# Altium project WanderDrive.PrjPcb (part 4 of 5)

## Sheet WanderDrive_AbsEnc.SchDoc
size A3; Date: Not shown in title block; ApprovedBy: Not shown in title block; CheckedBy: Not shown in title block; Author: Not shown in title block; CompanyName: Not shown in title block; Engineer: Not shown in title block; Organization: Not shown in title block; Address1: Not shown in title block; Address2: Not shown in title block; Address3: Not shown in title block; Address4: Not shown in title block; DocumentNumber: 1; Revision: Use project parameter SCH_Rev; SheetNumber: 3; SheetTotal: 4; PageSetup: Record=PageOptions|CenterHorizontal=True|CenterVertical=True|PrintScale=1.00|XCorrection=1.00|YCorrection=1.00|PrintKind=0|BorderSize=5000000|LeftOffset=0|BottomOffset=0|Orientation=2|PaperLength=1000|PaperWidth=1000|Scale=100|PaperSource=15|PrintQuality=600|MediaType=1|DitherType=10|PaperKind=Letter|PrintScaleMode=1; CurrentTime: Not shown in title block; CurrentDate: Not shown in title block; Time: Not shown in title block; DocumentFullPathAndName: Not shown in title block; DocumentName: Not shown in title block; ModifiedDate: Not shown in title block; ImagePath: Not shown in title block
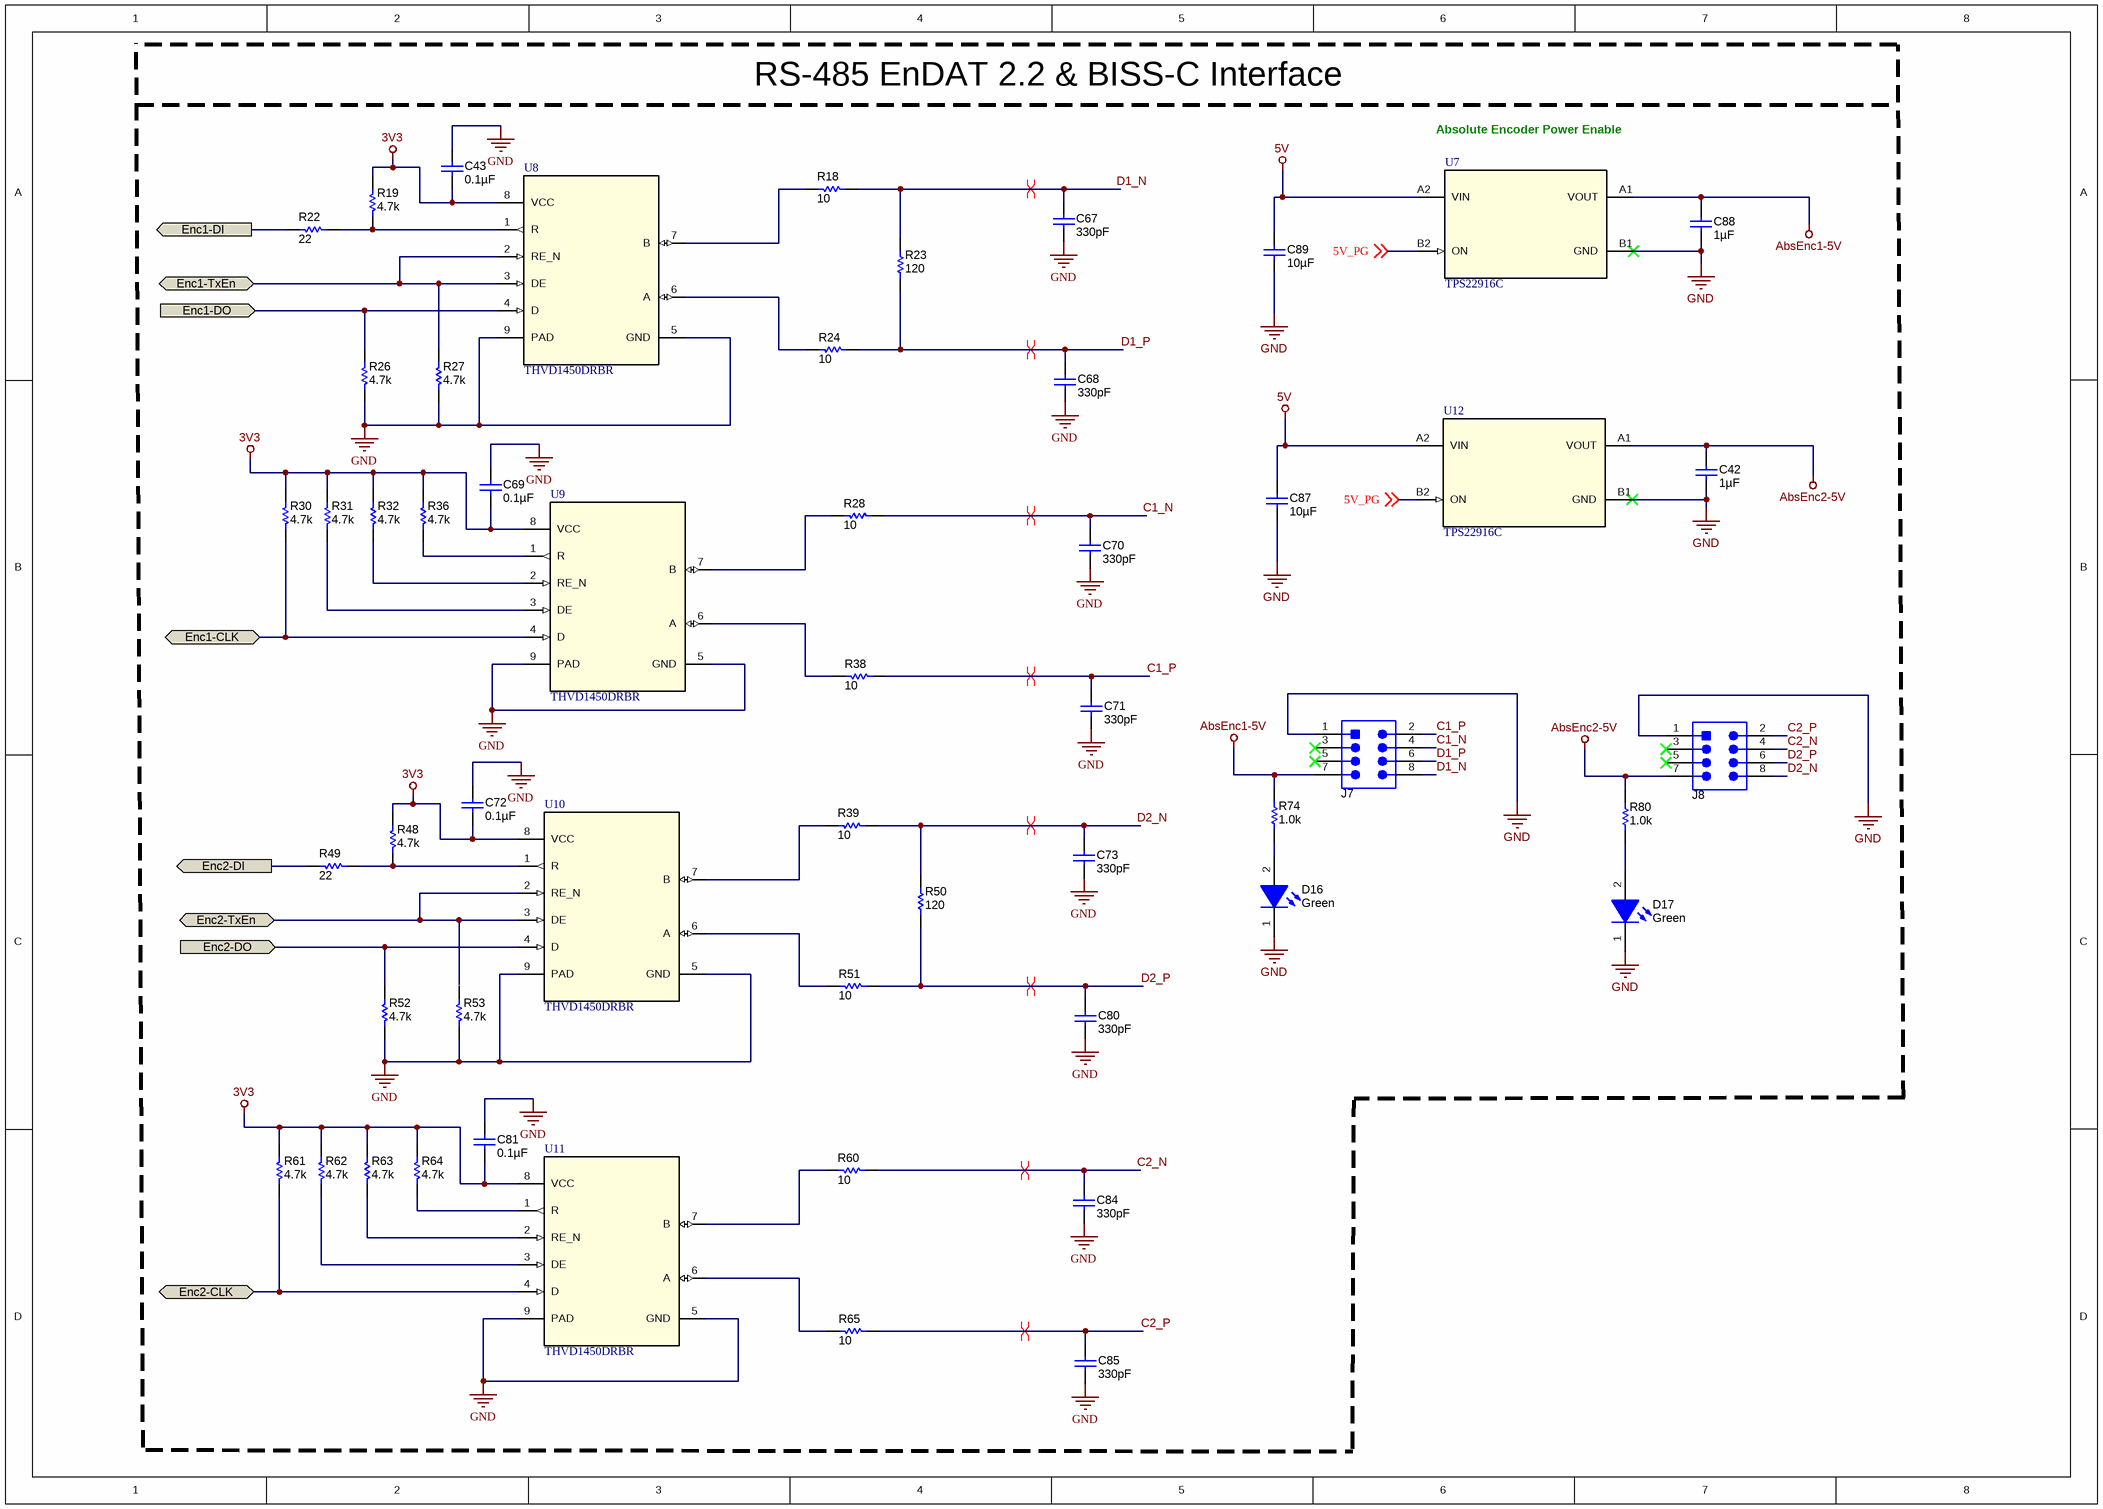
[diagram p2: WanderDrive_AbsEnc.SchDoc]

### Parts
C42  ValueDisplayed: 1µF  [0805_HV]  (hidden comment: TMK212BJ105KG-T)
C43  ValueDisplayed: 0.1µF  [0603]  (hidden comment: 06033D104KAT2A)
C67  ValueDisplayed: 330pF  [0603]  (hidden comment: GRM188R71H331KA01D)
C68  ValueDisplayed: 330pF  [0603]  (hidden comment: GRM188R71H331KA01D)
C69  ValueDisplayed: 0.1µF  [0603]  (hidden comment: 06033D104KAT2A)
C70  ValueDisplayed: 330pF  [0603]  (hidden comment: GRM188R71H331KA01D)
C71  ValueDisplayed: 330pF  [0603]  (hidden comment: GRM188R71H331KA01D)
C72  ValueDisplayed: 0.1µF  [0603]  (hidden comment: 06033D104KAT2A)
C73  ValueDisplayed: 330pF  [0603]  (hidden comment: GRM188R71H331KA01D)
C80  ValueDisplayed: 330pF  [0603]  (hidden comment: GRM188R71H331KA01D)
C81  ValueDisplayed: 0.1µF  [0603]  (hidden comment: 06033D104KAT2A)
C84  ValueDisplayed: 330pF  [0603]  (hidden comment: GRM188R71H331KA01D)
C85  ValueDisplayed: 330pF  [0603]  (hidden comment: GRM188R71H331KA01D)
C87  ValueDisplayed: 10µF  [0805_HV]  (hidden comment: GRM21BR61E106KA73L)
C88  ValueDisplayed: 1µF  [0805_HV]  (hidden comment: TMK212BJ105KG-T)
C89  ValueDisplayed: 10µF  [0805_HV]  (hidden comment: GRM21BR61E106KA73L)
D16  value Green  [WL-SMCW_GREEN]  (hidden comment: 150060GS75000)
D17  value Green  [WL-SMCW_GREEN]  (hidden comment: 150060GS75000)
J7  70246-0801  [Molex_70246-0801]  (value not drawn)
J8  70246-0801  [Molex_70246-0801]  (value not drawn)
R18  value 10  [0603]  (hidden comment: CRCW060310R0JNEAHP)
R19  value 4.7k  [0603]  (hidden comment: CRCW06034K70JNEA)
R22  value 22  [0603]  (hidden comment: CRCW060322R0JNEA)
R23  ValueDisplayed: 120  [0603]  (hidden comment: CRCW0603120RJNEA)
R24  value 10  [0603]  (hidden comment: CRCW060310R0JNEAHP)
R26  value 4.7k  [0603]  (hidden comment: CRCW06034K70JNEA)
R27  value 4.7k  [0603]  (hidden comment: CRCW06034K70JNEA)
R28  value 10  [0603]  (hidden comment: CRCW060310R0JNEAHP)
R30  value 4.7k  [0603]  (hidden comment: CRCW06034K70JNEA)
R31  value 4.7k  [0603]  (hidden comment: CRCW06034K70JNEA)
R32  value 4.7k  [0603]  (hidden comment: CRCW06034K70JNEA)
R36  value 4.7k  [0603]  (hidden comment: CRCW06034K70JNEA)
R38  value 10  [0603]  (hidden comment: CRCW060310R0JNEAHP)
R39  value 10  [0603]  (hidden comment: CRCW060310R0JNEAHP)
R48  value 4.7k  [0603]  (hidden comment: CRCW06034K70JNEA)
R49  value 22  [0603]  (hidden comment: CRCW060322R0JNEA)
R50  ValueDisplayed: 120  [0603]  (hidden comment: CRCW0603120RJNEA)
R51  value 10  [0603]  (hidden comment: CRCW060310R0JNEAHP)
R52  value 4.7k  [0603]  (hidden comment: CRCW06034K70JNEA)
R53  value 4.7k  [0603]  (hidden comment: CRCW06034K70JNEA)
R60  value 10  [0603]  (hidden comment: CRCW060310R0JNEAHP)
R61  value 4.7k  [0603]  (hidden comment: CRCW06034K70JNEA)
R62  value 4.7k  [0603]  (hidden comment: CRCW06034K70JNEA)
R63  value 4.7k  [0603]  (hidden comment: CRCW06034K70JNEA)
R64  value 4.7k  [0603]  (hidden comment: CRCW06034K70JNEA)
R65  value 10  [0603]  (hidden comment: CRCW060310R0JNEAHP)
R74  ValueDisplayed: 1.0k  [0402]  (hidden comment: CRCW04021K00JNED)
R80  ValueDisplayed: 1.0k  [0402]  (hidden comment: CRCW04021K00JNED)
U7  TPS22916C  [YFP0004ABAB]
U8  THVD1450DRBR  [DRB0008F]
U9  THVD1450DRBR  [DRB0008F]
U10  THVD1450DRBR  [DRB0008F]
U11  THVD1450DRBR  [DRB0008F]
U12  TPS22916C  [YFP0004ABAB]

### Ports
Enc1-CLK (bidir), Enc1-DI (out), Enc1-DO (in), Enc1-TxEn (bidir), Enc2-CLK (bidir), Enc2-DI (out), Enc2-DO (in), Enc2-TxEn (bidir)

### Nets
3V3: C43.1 C69.1 C72.1 C81.1 R19.2 R30.1 R31.1 R32.1 R36.1 R48.2 R61.1 R62.1 R63.1 R64.1 U8.8(VCC) U9.8(VCC) U10.8(VCC) U11.8(VCC)
5V: C87.1 C89.1 U7.A2(VIN) U12.A2(VIN)
AbsEnc1-5V: C88.1 J7.7 R74.2 U7.A1(VOUT)
AbsEnc2-5V: C42.1 J8.7 R80.2 U12.A1(VOUT)
GND: C42.2 C43.2 C67.1 C68.2 C69.2 C70.1 C71.2 C72.2 C73.1 C80.2 C81.2 C84.1 C85.2 C87.2 C88.2 C89.2 D16.1(K) D17.1(K) J7.1 J8.1 R26.2 R27.2 R52.2 R53.2 U7.B1(GND) U8.5(GND) U8.9(PAD) U9.5(GND) U9.9(PAD) U10.5(GND) U10.9(PAD) U11.5(GND) U11.9(PAD) U12.B1(GND)
5V_PG: U7.B2(ON) U12.B2(ON) ; off-sheet 5V_PG
C1_N: C70.2 J7.4 R28.1
C1_P: C71.1 J7.2 R38.1
C2_N: C84.2 J8.4 R60.1
C2_P: C85.1 J8.2 R65.1
D1_N: C67.2 J7.8 R18.1 R23.2
D1_P: C68.1 J7.6 R23.1 R24.1
D2_N: C73.2 J8.8 R39.1 R50.2
D2_P: C80.1 J8.6 R50.1 R51.1
Enc1-CLK: R30.2 U9.4(D) ; port Enc1-CLK
Enc1-DI: R22.2 ; port Enc1-DI
Enc1-DO: R26.1 U8.4(D) ; port Enc1-DO
Enc1-TxEn: U8.2(RE_N) U8.3(DE) ; port Enc1-TxEn
Enc2-CLK: R61.2 U11.4(D) ; port Enc2-CLK
Enc2-DI: R49.2 ; port Enc2-DI
Enc2-DO: R52.1 U10.4(D) ; port Enc2-DO
Enc2-TxEn: U10.2(RE_N) U10.3(DE) ; port Enc2-TxEn
NetD16_2: D16.2(A) R74.1
NetD17_2: D17.2(A) R80.1
NetR18_2: R18.2 U8.7(B)
NetR19_1: R19.1 R22.1 U8.1(R)
NetR24_2: R24.2 U8.6(A)
NetR28_2: R28.2 U9.7(B)
NetR31_2: R31.2 U9.3(DE)
NetR32_2: R32.2 U9.2(RE_N)
NetR36_2: R36.2 U9.1(R)
NetR38_2: R38.2 U9.6(A)
NetR39_2: R39.2 U10.7(B)
NetR48_1: R48.1 R49.1 U10.1(R)
NetR51_2: R51.2 U10.6(A)
NetR60_2: R60.2 U11.7(B)
NetR62_2: R62.2 U11.3(DE)
NetR63_2: R63.2 U11.2(RE_N)
NetR64_2: R64.2 U11.1(R)
NetR65_2: R65.2 U11.6(A)

Not connected (* = marked no-connect by the designer): J7 3* 5*; J8 3* 5*; R27 1; R53 1

### Layout directives
differential pair: C1_N, C1_P, C2_N, C2_P, D1_N, D1_P, D2_N, D2_P

### Notes on the sheet
- RS-485 EnDAT 2.2 & BISS-C Interface
- Absolute Encoder Power Enable
- Drawn By:
- SVN Rev:
- Number:
- TID #:
- Orderable:
- Rev:
- Sheet Title:
- File:
- Project Title:
- Designed for:
- Assembly Variant:
- Mod. Date:
- Sheet:
- Size:
- of
- B
- http://www.ti.com
- Texas Instruments and/or its licensors do not warrant the accuracy or completeness of this specification or any information contained therein. Texas Instruments and/or its licensors do not warrant that this design will meet the specifications, will be suitable for your application or fit for any particular purpose, or will operate in an implementation. Texas Instruments and/or its licensors do not warrant that the design is production worthy. You should completely validate and test your design implementation to confirm the system functionality for your application.
- Engineer:
- Contact:
- © Texas Instruments

### Library data of the parts
C42 C88 = TMK212BJ105KG-T: CAP, CERM, 1 µF, 20 V, +/- 10%, X5R, 0805; Manufacturer: Taiyo Yuden; Polarized: N; CompType: Capacitor; Value: 1uF; U/M: EA; Cap_F: 0.000001; Tolerance_%: 10; Value1: Unknown; VDC_V: 20; Value2: 20V; TaMin_C: -55; TaMax_C: 85; Cap_Case: 0805; SizeArea_mm2: 2.5; SizeAreaWB_mm2: 6.75; SizeX_mm: 2; SizeY_mm: 1.25; SizeZ_mm: 1.45; AEC Category: Q200; SymbolVersion: 2008-07-09; PartNumber: TMK212BJ105KG-T; PackageReference: 0805; RoHS: Y; MountType: SMT; Technology: Ceramic; TempCo: X5R; Published: 2008-06-19; Publisher: Texas Instruments; LatestRevisionDate: 2016-07-16; ComponentLink1Description: Datasheet link; ComponentLink1URL: http://www.yuden.co.jp/ut/product/pdf/djmk_e.pdf; Supplier 1: Digi-Key; Supplier Part Number 1: 587-1291-1-ND; Supplier 2: Farnell; Supplier Part Number 2: 8031575; Supplier 3: Newark; Supplier Part Number 3: 18J2754; AEC Qualified: ?
C43 C69 C72 C81 = 06033D104KAT2A: CAP, CERM, 0.1uF, 25V, +/-10%, X5R, 0603; Manufacturer: AVX; Polarized: N; CompType: Capacitor; U/M: EA; Cap_F: 0.0000001; Tolerance_%: 10; ESR_Ohm: 0.048; Value1: 0.048 ohm; VDC_V: 25; IRMS_A: 0.53; TaMin_C: -55; TaMax_C: 85; SymbolVersion: 2008-07-09; Value: 0.1uF; PartNumber: 06033D104KAT2A; PackageReference: 0603; RoHS: Y; Value2: 25V; MountType: SMT; Technology: Ceramic; TempCo: X5R; Cap_Case: 0603; Published: 2008-06-19; Publisher: Texas Instruments; LatestRevisionDate: 2014-03-28; ComponentLink1Description: Datasheet link; ComponentLink1URL: http://www.avx.com/docs/masterpubs/smccp.pdf; Supplier 1: Digi-Key; Supplier Part Number 1: 478-1244-1-ND; Supplier 2: Mouser; Supplier Part Number 2: 581-06033D104K
C67 C68 C70 C71 C73 C80 C84 C85 = GRM188R71H331KA01D: CAP, CERM, 330pF, 50V, +/-10%, X7R, 0603; Manufacturer: MuRata; Polarized: N; CompType: Capacitor; U/M: EA; Cap_F: 0.00000000033; Tolerance_%: 10; Value1: Unknown; VDC_V: 50; TaMin_C: -55; TaMax_C: 125; SymbolVersion: 2008-07-09; Value: 330pF; PartNumber: GRM188R71H331KA01D; PackageReference: 0603; RoHS: Y; Value2: 50V; MountType: SMT; Technology: Ceramic; TempCo: X7R; Cap_Case: 0603; Published: 2008-06-19; Publisher: Texas Instruments; LatestRevisionDate: 2014-03-28; ComponentLink1Description: Datasheet link; ComponentLink1URL: http://search.murata.co.jp/Ceramy/PnsearchViewAction.do?HnOFG=ON&HnNFG=ON&SEL_CNT=50&sLang=en&sKey=GRM188R71H331KA01D&x=9&y=9&search=startwith; Supplier 1: Digi-Key; Supplier Part Number 1: 490-1486-1-ND; Supplier 2: Mouser; Supplier Part Number 2: 81-GRM188R71H331KA01; Supplier 3: Farnell; Supplier Part Number 3: 1403787
C87 C89 = GRM21BR61E106KA73L: CAP, CERM, 10 µF, 25 V,+/- 10%, X5R, 0805; Manufacturer: MuRata; Polarized: N; CompType: Capacitor; Value: 10uF; U/M: EA; Cap_F: 0.00001; Tolerance_%: 10; Value1: Unknown; VDC_V: 25; Value2: 25V; TaMin_C: -55; TaMax_C: 85; Cap_Case: 0805; SizeArea_mm2: 2.5; SizeAreaWB_mm2: 6.75; SizeX_mm: 2; SizeY_mm: 1.25; SizeZ_mm: 1.45; AEC Category: Q200; Green_Lifecycle: Active; Green_REACh: Passed; SymbolVersion: 2008-07-09; PartNumber: GRM21BR61E106KA73L; PackageReference: 0805; RoHS: Y; MountType: SMT; Technology: Ceramic; TempCo: X5R; Published: 2008-06-19; Publisher: Texas Instruments; LatestRevisionDate: 2017-06-02; ComponentLink1Description: Datasheet link; ComponentLink1URL: http://www.murata.com/~/media/webrenewal/support/library/catalog/products/capacitor/mlcc/c02e.ashx; Supplier 1: Digi-Key; Supplier Part Number 1: 490-5523-1-ND; Supplier 2: Newark; Supplier Part Number 2: 24R6339; Supplier 3: Mouser; Supplier Part Number 3: 81-GRM21BR61E106KA3L; AEC Qualified: ?; Green_EU RoHS: Passed; Green_EU RoHS-2: Incomplete
D16 D17 = 150060GS75000: LED, Green, SMD; Manufacturer: Wurth Elektronik; Type: InGaN; Vf_V: 3.2; Value2: 3.2V; Io_A: 0.02; Tjmax_C: 85; Value1: W; Angle: 140; U/M: EA; Green_Lifecycle: Active; Green_REACh: Passed; CompType: LED; PartNumber: 150060GS75000; SymbolVersion: 2008-11-06; MountType: SMT; RoHS: Y; PackageReference: LED_0603; Color: Green; Published: 2008-07-11; Publisher: Texas Instruments; ComponentLink1URL: http://katalog.we-online.de/led/datasheet/150060GS75000.pdf; ComponentLink1Description: Datasheet link; LatestRevisionDate: 2017-05-19; Supplier 1: Digi-Key; Supplier Part Number 1: 732-4971-1-ND; Supplier 2: Newark; Supplier Part Number 2: 95W3794; Supplier 3: Mouser; Supplier Part Number 3: 710-150060GS75000; Green_EU RoHS: Passed; Green_EU RoHS-2: Incomplete
J7 J8 = 70246-0801: Header(shrouded), 2.54mm, 4x2, Gold, TH; Manufacturer: Molex; SymbolCreator: a0411947; Pitch_mm: 2.54; Gender: Male; Shrouded: Y; Row_Count: 2; Current_A: 2.5; Voltage_V: 250; SymbolVersion: 2013-12-22; PartNumber: 70246-0801; PackageReference: Header(shrouded), 2.54mm, 4x2, TH; CompType: Header; RoHS: Y; MountType: TH; ComponentLink1Description: Datasheet URL; ComponentLink1URL: http://www.molex.com/pdm_docs/sd/702460801_sd.pdf; Orientation: Vertical; PinCount: 8; RowSpacing_mm: 2.54; ContactFinish: Gold; Color: Black; Cert_CSA: Y; Cert_UL: Y; Publisher: Texas Instruments; LatestRevisionDate: 2016-07-19; Supplier 1: Digi-Key; Supplier Part Number 1: 70246-0801-ND; Supplier 2: Mouser; Supplier Part Number 2: 538-70246-0801
R18 R24 R28 R38 R39 R51 R60 R65 = CRCW060310R0JNEAHP: RES, 10 ohm, 5%, 0.25W, 0603; Manufacturer: Vishay-Dale; CompType: Resistor; Value_Code: 10R0; Tolerance_%: 5; Power_W: 0.25; VDC_V: 75; TempCo: 200 ppm/C; EIA_Code: E24; U/M: EA; SymbolVersion: 2009-05-29; PartNumber: CRCW060310R0JNEAHP; PackageReference: 0603; RoHS: Y; Res_ohm: 10; Value1: 5%; Value2: 0.25W; MountType: SMT; Technology: Thick Film; Published: 2008-06-26; Publisher: Texas Instruments; LatestRevisionDate: 2014-03-15; ComponentLink1Description: Datasheet link; ComponentLink1URL: http://www.vishay.com/docs/20043/crcwhpe3.pdf; Supplier 1: Digi-Key; Supplier Part Number 1: 541-10SACT-ND; Supplier 2: Mouser; Supplier Part Number 2: 71-CRCW060310R0JNEAH; Supplier 3: Farnell; Supplier Part Number 3: 24T7074
R19 R26 R27 R30-R32 R36 R48 R52 R53 R61-R64 = CRCW06034K70JNEA: RES, 4.7k ohm, 5%, 0.1W, 0603; Manufacturer: Vishay-Dale; CompType: Resistor; Res_ohm: 4700; Value_Code: 4k70; Tolerance_%: 5; Power_W: 0.1; VDC_V: 75; TempCo: 200 ppm/C; EIA_Code: E24; U/M: EA; SymbolVersion: 2009-05-29; PartNumber: CRCW06034K70JNEA; PackageReference: 0603; RoHS: Y; Value1: 5%; Value2: 0.1W; MountType: SMT; Technology: Thick Film; Published: 2008-06-26; Publisher: Texas Instruments; LatestRevisionDate: 2014-03-15; ComponentLink1Description: Datasheet link; ComponentLink1URL: http://www.vishay.com/docs/20035/dcrcwe3.pdf; Supplier 1: Mouser; Supplier Part Number 1: 71-CRCW0603J-4.7K-E3; Supplier 2: Farnell; Supplier Part Number 2: 1652884; Supplier 3: Newark; Supplier Part Number 3: 59M6811
R22 R49 = CRCW060322R0JNEA: RES, 22 ohm, 5%, 0.1W, 0603; Manufacturer: Vishay-Dale; CompType: Resistor; Value_Code: 22R0; Tolerance_%: 5; Power_W: 0.1; VDC_V: 75; TempCo: 200 ppm/C; EIA_Code: E24; U/M: EA; SymbolVersion: 2009-05-29; PartNumber: CRCW060322R0JNEA; PackageReference: 0603; RoHS: Y; Res_ohm: 22; Value1: 5%; Value2: 0.1W; MountType: SMT; Technology: Thick Film; Published: 2008-06-26; Publisher: Texas Instruments; LatestRevisionDate: 2014-04-07; ComponentLink1Description: Datasheet link; ComponentLink1URL: http://www.vishay.com/docs/20035/dcrcwe3.pdf; Supplier 1: Digi-Key; Supplier Part Number 1: 541-22GCT-ND; Supplier 2: Mouser; Supplier Part Number 2: 71-CRCW0603J-22-E3; Supplier 3: Farnell; Supplier Part Number 3: 1692521
R23 R50 = CRCW0603120RJNEA: RES, 120, 5%, 0.1 W, 0603; Manufacturer: Vishay-Dale; CompType: Resistor; Value: 120; Value_Code: 120R; Tolerance_%: 5; Power_W: 0.1; Value2: 0.1W; VDC_V: 75; TempCo: 200 ppm/C; SizeArea_mm2: 1.28; SizeX_mm: 1.6; SizeY_mm: 0.8; SizeZ_mm: 1; EIA_Code: E24; U/M: EA; AEC Category: Q200; SymbolVersion: 2009-05-29; PartNumber: CRCW0603120RJNEA; PackageReference: 0603; RoHS: Y; Res_ohm: 120; Value1: 5%; MountType: SMT; Technology: Thick Film; Published: 2008-06-26; Publisher: Texas Instruments; LatestRevisionDate: 2016-06-29; ComponentLink1Description: Datasheet link; ComponentLink1URL: http://www.vishay.com/docs/20035/dcrcwe3.pdf; Supplier 1: Digi-Key; Supplier Part Number 1: 541-120GCT-ND; Supplier 2: Mouser; Supplier Part Number 2: 71-CRCW0603J-120-E3; Supplier 3: Farnell; Supplier Part Number 3: 1514716; AEC Qualified: ?
R74 R80 = CRCW04021K00JNED: RES, 1.0 k, 5%, 0.063 W, 0402; Manufacturer: Vishay-Dale; CompType: Resistor; Value: 1.0k; Res_ohm: 1000; Value_Code: 1k00; Tolerance_%: 5; Power_W: 0.063; Value2: 0.063W; VDC_V: 50; TempCo: 200 ppm/C; SizeArea_mm2: 0.5; SizeX_mm: 1; SizeZ_mm: 0.6; EIA_Code: E24; U/M: EA; AEC Category: Q200; SymbolVersion: 2009-05-29; PartNumber: CRCW04021K00JNED; PackageReference: 0402; RoHS: Y; Value1: 5%; MountType: SMT; Technology: Thick Film; SizeY_mm: 0.5; Published: 2008-06-26; Publisher: Texas Instruments; LatestRevisionDate: 2016-07-14; ComponentLink1Description: Datasheet link; ComponentLink1URL: http://www.vishay.com/docs/20035/dcrcwe3.pdf; Supplier 1: Digi-Key; Supplier Part Number 1: 541-1.0KJCT-ND; Supplier 2: Mouser; Supplier Part Number 2: 71-CRCW0402J-1.0K-E3; Supplier 3: Farnell; Supplier Part Number 3: 1514656; AEC Qualified: ?
U7 U12 = TPS22916C: TPS22916CY Single-Channel Ultra-Low Leakage Load Switch 2A 60 mO 1V to 5.5V 4-Pin DSBGA T/R; Manufacturer: Texas Instruments; Manufacturer Part Number: TPS22916CYFPR; Number of Channels: 1; Fault Protection: Reverse Current; Output Configuration: High Side; Supplier 1: Digi-Key; RoHS: No; Stock 1: 2282; Pricing 1: 1=0,42000, 10=0,36400, 25=0,33960, 100=0,25220, 250=0,21340, 500=0,20370, 1000=0,15035 (USD); Min Operating Temperature: -40°C; Max Operating Temperature: 85°C; Packaging: Tape and Reel; Number of Outputs: 1; Max Output Current: 2A; ComponentLink1URL: http://www.ti.com/lit/ds/symlink/tps22916.pdf?src-supplier=Digi-Key; ComponentLink1Description: http://www.ti.com/lit/ds/symlink/tps22916.pdf?src-supplier=Digi-Key; Supplier Part Number 1: 296-50065-1-ND
U8-U11 = THVD1450DRBR: Manufacturer: Texas Instruments; Simplex/Duplex: Half Duplex; PartNumber: THVD1450DRBR; RefDes: RefDes; TYPE: TYPE; Value: Value; Supplier 1: Mouser; Manufacturer Part Number: THVD1450DRBR; RoHS: No; Stock 1: 8004; Pricing 1: 1=2,56000, 10=2,18000, 100=1,74000, 500=1,52000, 1000=1,26000, 3000=1,17000, 6000=1,13000, 9000=1,08000 (USD); Min Operating Temperature: -40°C; Max Operating Temperature: 125°C; Supplier Part Number 1: 595-THVD1450DRBR

## Sheet WanderDrive_EtherCAT.SchDoc
size A2; Date: Not shown in title block; ApprovedBy: Not shown in title block; CheckedBy: Not shown in title block; Author: Not shown in title block; CompanyName: Not shown in title block; Engineer: Not shown in title block; Organization: Not shown in title block; Address1: Not shown in title block; Address2: Not shown in title block; Address3: Not shown in title block; Address4: Not shown in title block; DocumentNumber: 8; Revision: Use project parameter SCH_Rev; SheetNumber: 8; SheetTotal: 11; PageSetup: Record=PageOptions|CenterHorizontal=True|CenterVertical=True|PrintScale=1.00|XCorrection=1.00|YCorrection=1.00|PrintKind=0|BorderSize=5000000|LeftOffset=0|BottomOffset=0|Orientation=2|PaperLength=1000|PaperWidth=1000|Scale=100|PaperSource=15|PrintQuality=600|MediaType=1|DitherType=10|PaperKind=Letter|PrintScaleMode=1; CurrentTime: Not shown in title block; CurrentDate: Not shown in title block; Time: Not shown in title block; DocumentFullPathAndName: Not shown in title block; DocumentName: Not shown in title block; ModifiedDate: Not shown in title block; ImagePath: Not shown in title block
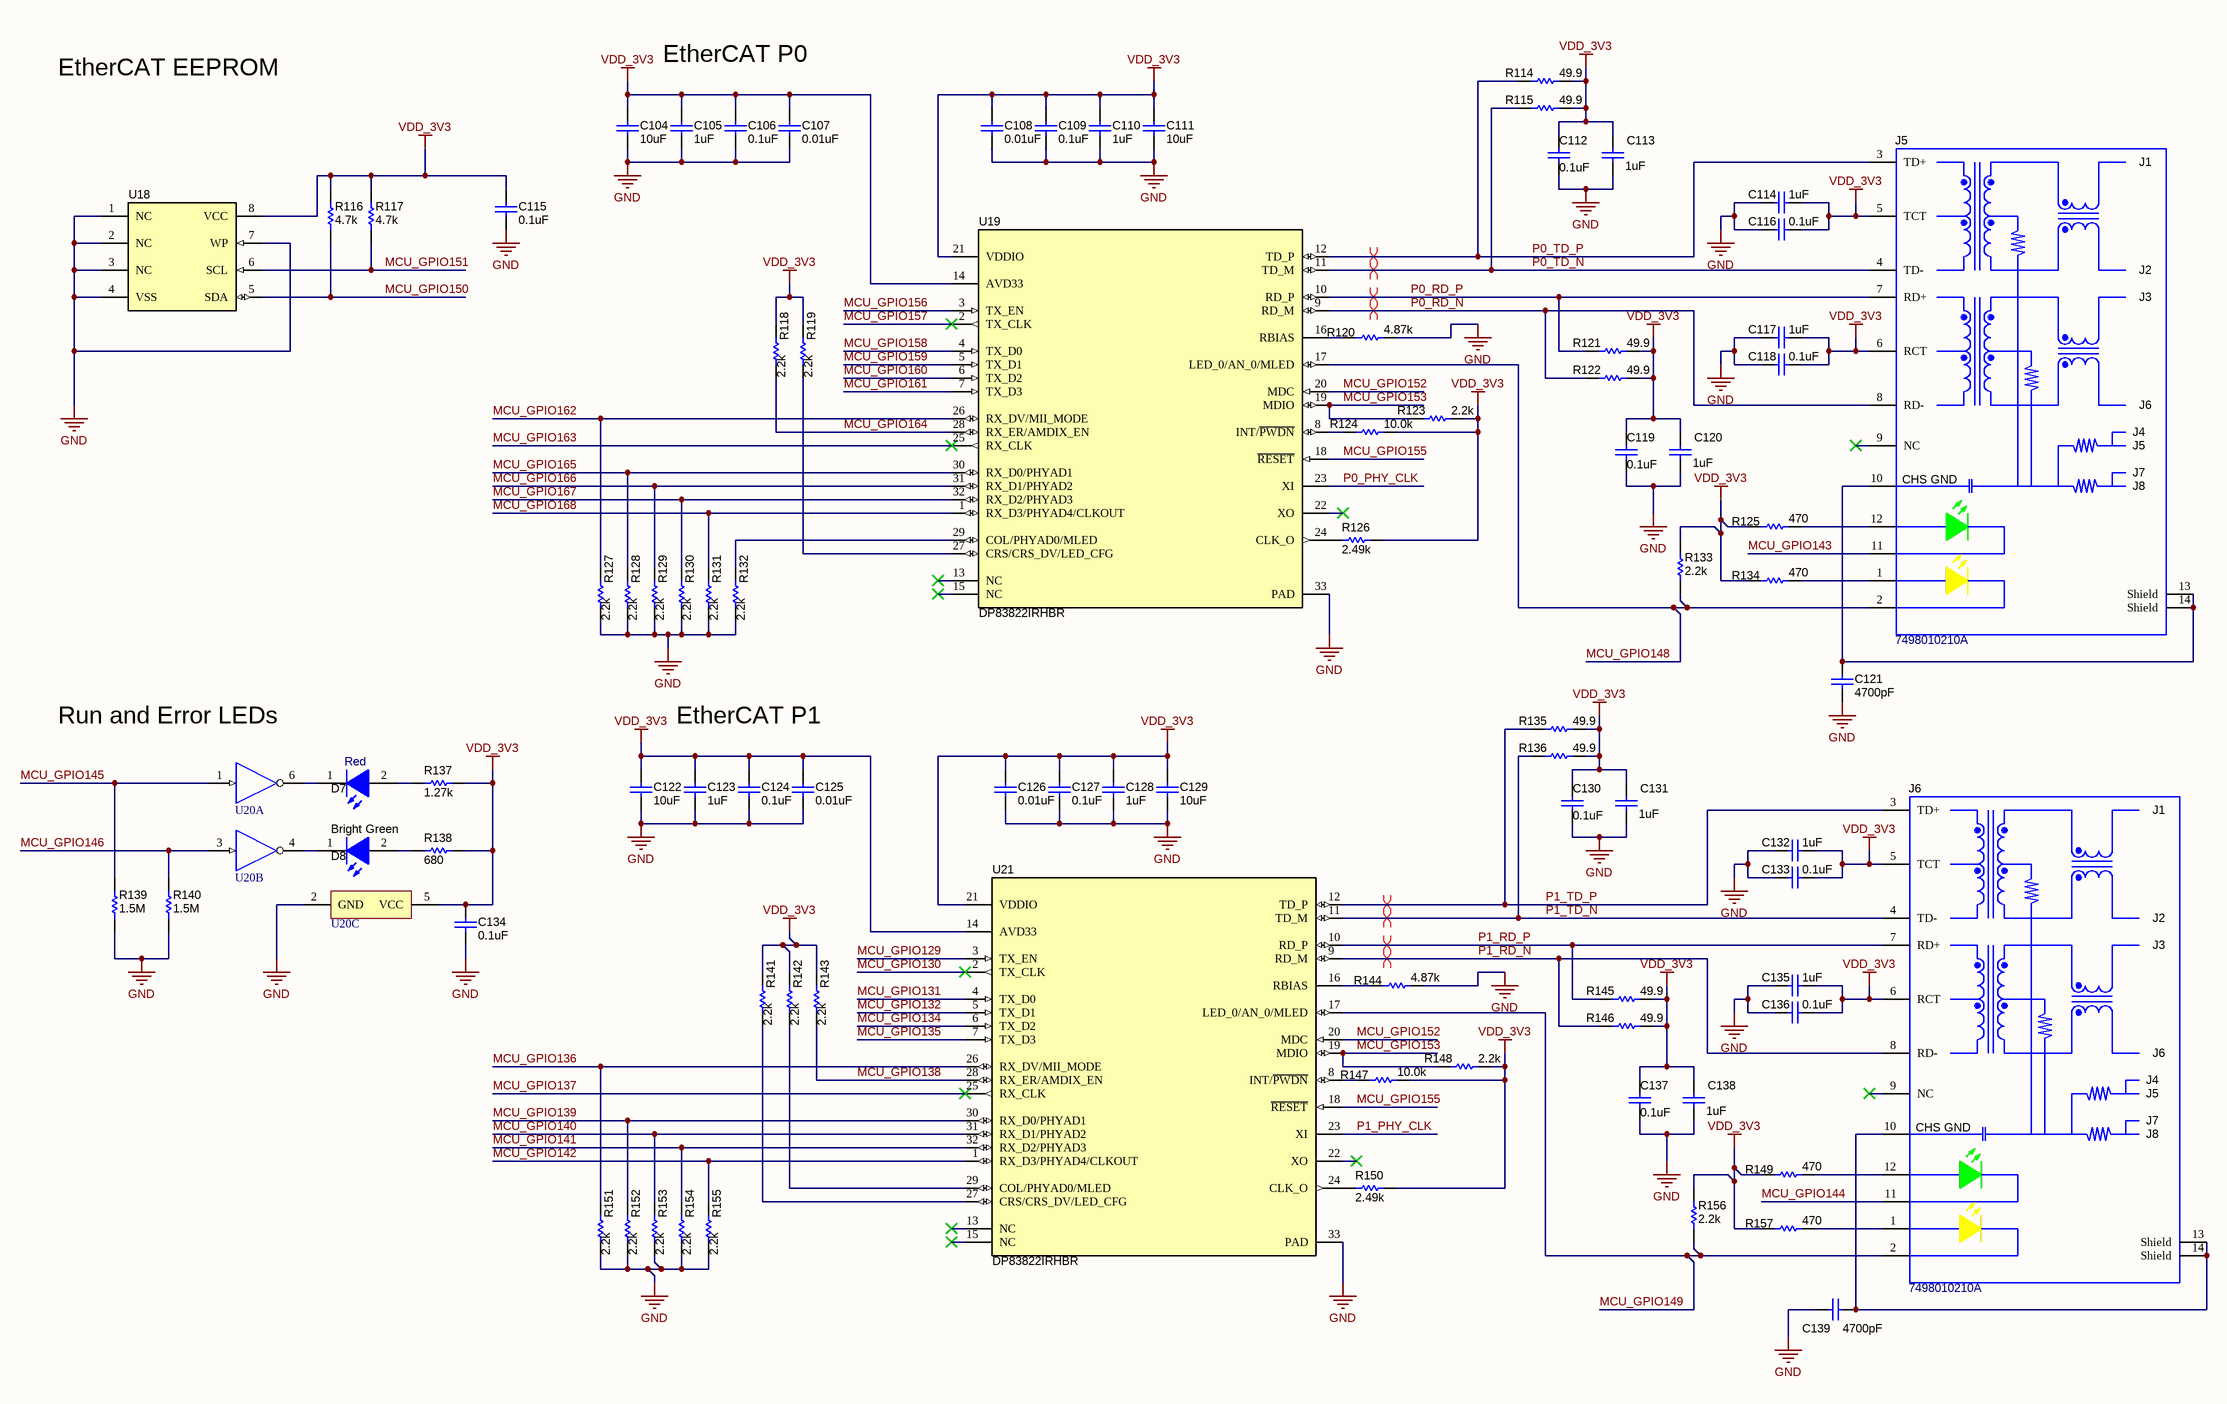
[diagram p3: WanderDrive_EtherCAT.SchDoc]

### Parts
(Parts that share a designator on the sheet are numbered #1, #2 ... from top to bottom, then left to right.)
C104  ValueDisplayed: 10uF  [0402]  (hidden comment: CL05A106MQ5NUNC)
C105  ValueDisplayed: 1uF  [0402]  (hidden comment: EMK105BJ105KVHF)
C106  ValueDisplayed: 0.1uF  [0402]  (hidden comment: LMK105BJ104KV-F)
C107  ValueDisplayed: 0.01uF  [0402]  (hidden comment: 885012205031)
C108  ValueDisplayed: 0.01uF  [0402]  (hidden comment: 885012205031)
C109  ValueDisplayed: 0.1uF  [0402]  (hidden comment: LMK105BJ104KV-F)
C110  ValueDisplayed: 1uF  [0402]  (hidden comment: EMK105BJ105KVHF)
C111  ValueDisplayed: 10uF  [0402]  (hidden comment: CL05A106MQ5NUNC)
C112  ValueDisplayed: 0.1uF  [0402]  (hidden comment: LMK105BJ104KV-F)
C113  ValueDisplayed: 1uF  [0402]  (hidden comment: EMK105BJ105KVHF)
C114  ValueDisplayed: 1uF  [0402]  (hidden comment: EMK105BJ105KVHF)
C115  ValueDisplayed: 0.1uF  [0402]  (hidden comment: CL05B104KP5NNNC)
C116  ValueDisplayed: 0.1uF  [0402]  (hidden comment: LMK105BJ104KV-F)
C117  ValueDisplayed: 1uF  [0402]  (hidden comment: EMK105BJ105KVHF)
C118  ValueDisplayed: 0.1uF  [0402]  (hidden comment: LMK105BJ104KV-F)
C119  ValueDisplayed: 0.1uF  [0402]  (hidden comment: LMK105BJ104KV-F)
C120  ValueDisplayed: 1uF  [0402]  (hidden comment: EMK105BJ105KVHF)
C121  ValueDisplayed: 4700pF  [1206]  (hidden comment: 12061C472KAT2A)
C122  ValueDisplayed: 10uF  [0402]  (hidden comment: CL05A106MQ5NUNC)
C123  ValueDisplayed: 1uF  [0402]  (hidden comment: EMK105BJ105KVHF)
C124  ValueDisplayed: 0.1uF  [0402]  (hidden comment: LMK105BJ104KV-F)
C125  ValueDisplayed: 0.01uF  [0402]  (hidden comment: 885012205031)
C126  ValueDisplayed: 0.01uF  [0402]  (hidden comment: 885012205031)
C127  ValueDisplayed: 0.1uF  [0402]  (hidden comment: LMK105BJ104KV-F)
C128  ValueDisplayed: 1uF  [0402]  (hidden comment: EMK105BJ105KVHF)
C129  ValueDisplayed: 10uF  [0402]  (hidden comment: CL05A106MQ5NUNC)
C130  ValueDisplayed: 0.1uF  [0402]  (hidden comment: LMK105BJ104KV-F)
C131  ValueDisplayed: 1uF  [0402]  (hidden comment: EMK105BJ105KVHF)
C132  ValueDisplayed: 1uF  [0402]  (hidden comment: EMK105BJ105KVHF)
C133  ValueDisplayed: 0.1uF  [0402]  (hidden comment: LMK105BJ104KV-F)
C134  ValueDisplayed: 0.1uF  [0402]  (hidden comment: CL05B104KP5NNNC)
C135  ValueDisplayed: 1uF  [0402]  (hidden comment: EMK105BJ105KVHF)
C136  ValueDisplayed: 0.1uF  [0402]  (hidden comment: LMK105BJ104KV-F)
C137  ValueDisplayed: 0.1uF  [0402]  (hidden comment: LMK105BJ104KV-F)
C138  ValueDisplayed: 1uF  [0402]  (hidden comment: EMK105BJ105KVHF)
C139  ValueDisplayed: 4700pF  [1206]  (hidden comment: 12061C472KAT2A)
D7  value Red  [WL-SMCW_RED_0805]  (hidden comment: 150080SS75000)
D8  value Bright Green  [WL-SMCW_Green_0805]  (hidden comment: 150080VS75000)
J5#2  7498010210A  [Wurth_7498010210A]
J6#2  7498010210A  [Wurth_7498010210A]
R114  ValueDisplayed: 49.9  [0402]  (hidden comment: RC0402FR-0749R9L)
R115  ValueDisplayed: 49.9  [0402]  (hidden comment: RC0402FR-0749R9L)
R116  ValueDisplayed: 4.7k  [0402]  (hidden comment: CRCW04024K70JNED)
R117  ValueDisplayed: 4.7k  [0402]  (hidden comment: CRCW04024K70JNED)
R118#2  ValueDisplayed: 2.2k  [0201]  (hidden comment: CRCW02012K20JNED)
R119#2  ValueDisplayed: 2.2k  [0201]  (hidden comment: CRCW02012K20JNED)
R120#2  ValueDisplayed: 4.87k  [0402]  (hidden comment: CRCW04024K87FKED)
R121#2  ValueDisplayed: 49.9  [0402]  (hidden comment: RC0402FR-0749R9L)
R122#2  ValueDisplayed: 49.9  [0402]  (hidden comment: RC0402FR-0749R9L)
R123#2  ValueDisplayed: 2.2k  [0402]  (hidden comment: CRCW04022K20JNED)
R124#2  ValueDisplayed: 10.0k  [0402]  (hidden comment: RC0402FR-0710KL)
R125#2  ValueDisplayed: 470  [0603]  (hidden comment: CRCW0603470RJNEA)
R126#2  ValueDisplayed: 2.49k  [0402]  (hidden comment: CRCW04022K49FKED)
R127#2  ValueDisplayed: 2.2k  [0201]  (hidden comment: CRCW02012K20JNED)
R128  ValueDisplayed: 2.2k  [0201]  (hidden comment: CRCW02012K20JNED)
R129  ValueDisplayed: 2.2k  [0201]  (hidden comment: CRCW02012K20JNED)
R130  ValueDisplayed: 2.2k  [0201]  (hidden comment: CRCW02012K20JNED)
R131  ValueDisplayed: 2.2k  [0201]  (hidden comment: CRCW02012K20JNED)
R132  ValueDisplayed: 2.2k  [0201]  (hidden comment: CRCW02012K20JNED)
R133  ValueDisplayed: 2.2k  [0402]  (hidden comment: CRCW04022K20JNED)
R134  ValueDisplayed: 470  [0603]  (hidden comment: CRCW0603470RJNEA)
R135  ValueDisplayed: 49.9  [0402]  (hidden comment: RC0402FR-0749R9L)
R136  ValueDisplayed: 49.9  [0402]  (hidden comment: RC0402FR-0749R9L)
R137  ValueDisplayed: 1.27k  [0402]  (hidden comment: CRCW04021K27FKED)
R138#2  ValueDisplayed: 680  [0402]  (hidden comment: CRCW0402680RJNED)
R139#2  ValueDisplayed: 1.5M  [0402]  (hidden comment: CRCW04021M50JNED)
R140  ValueDisplayed: 1.5M  [0402]  (hidden comment: CRCW04021M50JNED)
R141  ValueDisplayed: 2.2k  [0201]  (hidden comment: CRCW02012K20JNED)
R142  ValueDisplayed: 2.2k  [0201]  (hidden comment: CRCW02012K20JNED)
R143#2  ValueDisplayed: 2.2k  [0201]  (hidden comment: CRCW02012K20JNED)
R144#2  ValueDisplayed: 4.87k  [0402]  (hidden comment: CRCW04024K87FKED)
R145#2  ValueDisplayed: 49.9  [0402]  (hidden comment: RC0402FR-0749R9L)
R146#2  ValueDisplayed: 49.9  [0402]  (hidden comment: RC0402FR-0749R9L)
R147#2  ValueDisplayed: 10.0k  [0402]  (hidden comment: RC0402FR-0710KL)
R148#2  ValueDisplayed: 2.2k  [0402]  (hidden comment: CRCW04022K20JNED)
R149  ValueDisplayed: 470  [0603]  (hidden comment: CRCW0603470RJNEA)
R150  ValueDisplayed: 2.49k  [0402]  (hidden comment: CRCW04022K49FKED)
R151  ValueDisplayed: 2.2k  [0201]  (hidden comment: CRCW02012K20JNED)
R152  ValueDisplayed: 2.2k  [0201]  (hidden comment: CRCW02012K20JNED)
R153  ValueDisplayed: 2.2k  [0201]  (hidden comment: CRCW02012K20JNED)
R154  ValueDisplayed: 2.2k  [0201]  (hidden comment: CRCW02012K20JNED)
R155  ValueDisplayed: 2.2k  [0201]  (hidden comment: CRCW02012K20JNED)
R156  ValueDisplayed: 2.2k  [0402]  (hidden comment: CRCW04022K20JNED)
R157  ValueDisplayed: 470  [0603]  (hidden comment: CRCW0603470RJNEA)
U18  CAT24C16WI-GT3  [SOIC-8]  (value not drawn)
U19  DP83822IRHBR  [RHB0032B]
U20  SN74LVC2G06DBVR  [DBV0006A_N]  (value not drawn)  (parts A,B,C of 3)
U21  DP83822IRHBR  [RHB0032B]

### Nets
GND: C104.2 C105.2 C106.2 C107.2 C108.2 C109.2 C110.2 C111.2 C112.2 C113.2 C114.1 C115.2 C116.1 C117.1 C118.1 C119.2 C120.2 C121.1 C122.2 C123.2 C124.2 C125.2 C126.2 C127.2 C128.2 C129.2 C130.2 C131.2 C132.1 C133.1 C134.2 C135.1 C136.1 C137.2 C138.2 C139.1 R120#2.2 R127#2.1 R128.1 R129.1 R130.1 R131.1 R132.1 R139#2.2 R140.2 R144#2.2 R151.1 R152.1 R153.1 R154.1 R155.1 U18.1(NC) U18.2(NC) U18.3(NC) U18.4(VSS) U18.7(WP) U19.33(PAD) U20.2(GND) U21.33(PAD)
VDD_3V3: C104.1 C105.1 C106.1 C107.1 C108.1 C109.1 C110.1 C111.1 C112.1 C113.1 C114.2 C115.1 C116.2 C117.2 C118.2 C119.1 C120.1 C122.1 C123.1 C124.1 C125.1 C126.1 C127.1 C128.1 C129.1 C130.1 C131.1 C132.2 C133.2 C134.1 C135.2 C136.2 C137.1 C138.1 J5#2.5(TCT) J5#2.6(RCT) J6#2.5(TCT) J6#2.6(RCT) R114.2 R115.2 R116.2 R117.2 R118#2.2 R119#2.2 R121#2.2 R122#2.2 R123#2.1 R124#2.2 R125#2.1 R126#2.1 R133.2 R134.1 R135.2 R136.2 R137.2 R138#2.1 R141.2 R142.2 R143#2.2 R145#2.2 R146#2.2 R147#2.2 R148#2.1 R149.1 R150.1 R156.2 R157.1 U18.8(VCC) U19.14(AVD33) U19.21(VDDIO) U20.5(VCC) U21.14(AVD33) U21.21(VDDIO)
MCU_GPIO129: U21.3(TX_EN)
MCU_GPIO130: U21.2(TX_CLK)
MCU_GPIO131: U21.4(TX_D0)
MCU_GPIO132: U21.5(TX_D1)
MCU_GPIO134: U21.6(TX_D2)
MCU_GPIO135: U21.7(TX_D3)
MCU_GPIO136: R151.2 U21.26(RX_DV/MII_MODE)
MCU_GPIO137: U21.25(RX_CLK)
MCU_GPIO138: R143#2.1 U21.28(RX_ER/AMDIX_EN)
MCU_GPIO139: R152.2 U21.30(RX_D0/PHYAD1)
MCU_GPIO140: R153.2 U21.31(RX_D1/PHYAD2)
MCU_GPIO141: R154.2 U21.32(RX_D2/PHYAD3)
MCU_GPIO142: R155.2 U21.1(RX_D3/PHYAD4/CLKOUT)
MCU_GPIO143: J5#2.11(LEFT_LED_CATHODE)
MCU_GPIO144: J6#2.11(LEFT_LED_CATHODE)
MCU_GPIO145: R139#2.1 U20.1(1A)
MCU_GPIO146: R140.1 U20.3(2A)
MCU_GPIO148: J5#2.2(RIGHT_LED_CATHODE) R133.1 U19.17(LED_0/AN_0/MLED)
MCU_GPIO149: J6#2.2(RIGHT_LED_CATHODE) R156.1 U21.17(LED_0/AN_0/MLED)
MCU_GPIO150: R116.1 U18.5(SDA)
MCU_GPIO151: R117.1 U18.6(SCL)
MCU_GPIO152: U19.20(MDC) U21.20(MDC)
MCU_GPIO153: R123#2.2 R148#2.2 U19.19(MDIO) U21.19(MDIO)
MCU_GPIO155: U19.18(~{RESET}) U21.18(~{RESET})
MCU_GPIO156: U19.3(TX_EN)
MCU_GPIO157: U19.2(TX_CLK)
MCU_GPIO158: U19.4(TX_D0)
MCU_GPIO159: U19.5(TX_D1)
MCU_GPIO160: U19.6(TX_D2)
MCU_GPIO161: U19.7(TX_D3)
MCU_GPIO162: R127#2.2 U19.26(RX_DV/MII_MODE)
MCU_GPIO163: U19.25(RX_CLK)
MCU_GPIO164: R118#2.1 U19.28(RX_ER/AMDIX_EN)
MCU_GPIO165: R128.2 U19.30(RX_D0/PHYAD1)
MCU_GPIO166: R129.2 U19.31(RX_D1/PHYAD2)
MCU_GPIO167: R130.2 U19.32(RX_D2/PHYAD3)
MCU_GPIO168: R131.2 U19.1(RX_D3/PHYAD4/CLKOUT)
P0_PHY_CLK: U19.23(XI)
P0_RD_N: J5#2.8(RD-) R122#2.1 U19.9(RD_M)
P0_RD_P: J5#2.7(RD+) R121#2.1 U19.10(RD_P)
P0_TD_N: J5#2.4(TD-) R115.1 U19.11(TD_M)
P0_TD_P: J5#2.3(TD+) R114.1 U19.12(TD_P)
P1_PHY_CLK: U21.23(XI)
P1_RD_N: J6#2.8(RD-) R146#2.1 U21.9(RD_M)
P1_RD_P: J6#2.7(RD+) R145#2.1 U21.10(RD_P)
P1_TD_N: J6#2.4(TD-) R136.1 U21.11(TD_M)
P1_TD_P: J6#2.3(TD+) R135.1 U21.12(TD_P)
NetC121_2: C121.2 J5#2.10(CHS_GND) J5#2.13(Shield) J5#2.14(Shield)
NetC139_2: C139.2 J6#2.10(CHS_GND) J6#2.13(Shield) J6#2.14(Shield)
NetD7_1: D7.1(K) U20.6(1Y)
NetD7_2: D7.2(A) R137.1
NetD8_1: D8.1(K) U20.4(2Y)
NetD8_2: D8.2(A) R138#2.2
NetJ5#2_1: J5#2.1(RIGHT_LED_ANODE) R134.2
NetJ5#2_12: J5#2.12(LEFT_LED_ANODE) R125#2.2
NetJ6#2_1: J6#2.1(RIGHT_LED_ANODE) R157.2
NetJ6#2_12: J6#2.12(LEFT_LED_ANODE) R149.2
NetR119#2_1: R119#2.1 U19.27(CRS/CRS_DV/LED_CFG)
NetR120#2_1: R120#2.1 U19.16(RBIAS)
NetR124#2_1: R124#2.1 U19.8(INT/~{PWDN})
NetR126#2_2: R126#2.2 U19.24(CLK_O)
NetR132_2: R132.2 U19.29(COL/PHYAD0/MLED)
NetR141_1: R141.1 U21.27(CRS/CRS_DV/LED_CFG)
NetR142_1: R142.1 U21.29(COL/PHYAD0/MLED)
NetR144#2_1: R144#2.1 U21.16(RBIAS)
NetR147#2_1: R147#2.1 U21.8(INT/~{PWDN})
NetR150_2: R150.2 U21.24(CLK_O)

Not connected (* = marked no-connect by the designer): J5#2 9(NC)*; J6#2 9(NC)*; U19 13(NC)* 15(NC)* 22(XO)*; U21 13(NC)* 15(NC)* 22(XO)*

### Layout directives
differential pair: P0_RD_N, P0_RD_P, P0_TD_N, P0_TD_P, P1_RD_N, P1_RD_P, P1_TD_N, P1_TD_P

### Notes on the sheet
- EtherCAT EEPROM
- EtherCAT P0
- Run and Error LEDs
- EtherCAT P1
- Title
- Size:
- Date:
- File:
- A2
- Number:
- Time:
- Revision:
- Sheet
- of
- (in symbol CMP-0086350-1) J1; J2; J3; J6; J4; J7; J8; J5

### Library data of the parts
C104 C111 C122 C129 = CMP-0006340-2: CAP, CERM, 10 uF, 6.3 V, +/- 20%, X5R, 0402; Manufacturer: Samsung Electro-Mechanics; TaMin_C: -55°C; Polarized: N; SizeAreaWB_mm2: 3; Value1: Unknown; U/M: EA; Value: 10uF; TaMax_C: 85°C; SizeZ_mm: 0.6; SizeX_mm: 1; SizeY_mm: 0.5; Value2: 6.3V; Cap_F: 10µF; AEC Category: Q200; Publisher: Texas Instruments; TempCo: X5R; Published: 2008-06-19; RoHS: Y; MountType: SMT; PackageReference: 0402; Tolerance_%: 20%; Cap_Case: 0402; SizeArea_mm2: 0.5; CompType: Capacitor; LatestRevisionDate: 2017-03-09; PartNumber: CL05A106MQ5NUNC; AEC Qualified: ?; ComponentLink1Description: Datasheet link; Technology: Ceramic; ComponentLink1URL: http://www.samsungsem.com/servlet/DownloadServlet?dir=partnumber&num=&fileName=CL05A106MQ5NUNC.pdf
C105 C110 C113 C114 C117 C120 C123 C128 C131 C132 C135 C138 = CMP-0006347-2: CAP, CERM, 1 uF, 16 V, +/- 10%, X5R, 0402; Manufacturer: Taiyo Yuden; TaMin_C: -55°C; Polarized: N; SizeAreaWB_mm2: 3; Value1: Unknown; U/M: EA; Value: 1uF; TaMax_C: 85°C; SizeZ_mm: 0.6; SizeX_mm: 1; SizeY_mm: 0.5; Value2: 16V; Cap_F: 1µF; AEC Category: Q200; Supplier Part Number 2: 68X1293; Publisher: Texas Instruments; Supplier 2: Newark; TempCo: X5R; Published: 2008-06-19; RoHS: Y; MountType: SMT; Supplier 1: Digi-Key; PackageReference: 0402; Tolerance_%: 10%; Cap_Case: 0402; SizeArea_mm2: 0.5; CompType: Capacitor; LatestRevisionDate: 2017-03-09; PartNumber: EMK105BJ105KVHF; AEC Qualified: ?; ComponentLink1Description: Datasheet link; Supplier Part Number 1: 587-3709-2-ND; Technology: Ceramic; ComponentLink1URL: http://www.yuden.co.jp/ut/product/category/capacitor/EMK105BJ105KVHF_SS.pdf
C106 C109 C112 C116 C118 C119 C124 C127 C130 C133 C136 C137 = CMP-0064930-2: CAP, CERM, 0.1 uF, 10 V,+/- 10%, X5R, 0402; Manufacturer: Taiyo Yuden; TaMin_C: -55°C; Polarized: N; SizeAreaWB_mm2: 3; Value1: Unknown; U/M: EA; Value: 0.1uF; TaMax_C: 85°C; SizeZ_mm: 0.6; SizeX_mm: 1; SizeY_mm: 0.5; Value2: 10V; Cap_F: 100nF; AEC Category: Q200; Supplier Part Number 2: 86H5618; Publisher: Texas Instruments; Supplier 2: Newark; Supplier Part Number 3: 963-LMK105BJ104KV-F; TempCo: X5R; Supplier 3: Mouser; Published: 2008-06-19; RoHS: Y; MountType: SMT; Supplier 1: Digi-Key; PackageReference: 0402; Tolerance_%: 10%; Cap_Case: 0402; SizeArea_mm2: 0.5; CompType: Capacitor; LatestRevisionDate: 2017-06-05; PartNumber: LMK105BJ104KV-F; AEC Qualified: N; ComponentLink1Description: Datasheet link; AEC Grade: N/A; Supplier Part Number 1: 587-1227-1-ND; Technology: Ceramic; ComponentLink1URL: http://ds.yuden.co.jp/TYCOMPAS/ut/detail.do?productNo=LMK105BJ104KV-F&fileName=LMK105BJ104KV-F_SS&mode=specSheetDownload; VDC_V: 10V
C107 C108 C125 C126 = CMP-0006227-2: CAP, CERM, 0.01 uF, 16 V, +/- 10%, X7R, 0402; Manufacturer: Wurth Elektronik; TaMin_C: -55°C; Polarized: N; SizeAreaWB_mm2: 3; Value1: Unknown; U/M: EA; Value: 0.01uF; TaMax_C: 125°C; SizeZ_mm: 0.6; SizeX_mm: 1; SizeY_mm: 0.5; Value2: 16V; Cap_F: 10nF; AEC Category: Q200; Publisher: Texas Instruments; TempCo: X7R; Published: 2008-06-19; RoHS: Y; MountType: SMT; Supplier 1: Mouser; PackageReference: 0402; Tolerance_%: 10%; Cap_Case: 0402; SizeArea_mm2: 0.5; CompType: Capacitor; LatestRevisionDate: 2017-03-09; PartNumber: 885012205031; AEC Qualified: N; ComponentLink1Description: Datasheet link; AEC Grade: N/A; Supplier Part Number 1: 710-885012205031; Technology: Ceramic; ComponentLink1URL: http://katalog.we-online.de/pbs/datasheet/885012205031.pdf
C115 C134 = CMP-0006343-2: CAP, CERM, 0.1 uF, 10 V, +/- 10%, X7R, 0402; Manufacturer: Samsung Electro-Mechanics; Polarized: N; Value: 0.1uF; U/M: EA; Cap_F: 100nF; Value1: Unknown; VDC_V: 10V; TaMin_C: -55°C; TaMax_C: 125°C; AEC Category: Q200; SizeArea_mm2: 0.5; SizeAreaWB_mm2: 3; SizeX_mm: 1; SizeZ_mm: 0.6; CompType: Capacitor; PartNumber: CL05B104KP5NNNC; PackageReference: 0402; RoHS: Y; Tolerance_%: 10%; Value2: 10V; MountType: SMT; Technology: Ceramic; TempCo: X7R; Cap_Case: 0402; Published: 2008-06-19; Publisher: Texas Instruments; LatestRevisionDate: 2017-03-09; ComponentLink1Description: Datasheet link; ComponentLink1URL: http://www.samsungsem.com/kr/front/downloadcms.do?path=/kr/support/product-search/mlcc/__icsFiles/afieldfile/2014/11/05&fileName=S_CL05B104KP5NNNC.pdf; AEC Qualified: N; AEC Grade: N/A; SizeY_mm: 0.5
C121 C139 = CMP-0008501-2: CAP, CERM, 4700 pF, 100 V, +/- 10%, X7R, 1206; Manufacturer: AVX; TaMin_C: -55°C; ESR_ohm: 1.78d; Polarized: N; SizeAreaWB_mm2: 10.92; Value1: 0.178 ohm; U/M: EA; Value: 4700pF; TaMax_C: 125°C; SizeZ_mm: 1.35; SizeX_mm: 3.2; SizeY_mm: 1.6; Value2: 100V; SizeArea_mm2: 5.12; Cap_F: 4.7nF; AEC Category: Q200; Supplier Part Number 2: 96M1479; Publisher: Texas Instruments; Supplier 2: Newark; Supplier Part Number 3: 581-12061C472K; TempCo: X7R; Supplier 3: Mouser; Published: 2008-06-19; RoHS: Y; MountType: SMT; Supplier 1: Digi-Key; PackageReference: 1206; Tolerance_%: 10%; Cap_Case: 1206; CompType: Capacitor; LatestRevisionDate: 2017-03-09; PartNumber: 12061C472KAT2A; AEC Qualified: N; ComponentLink1Description: Datasheet link; AEC Grade: N/A; Supplier Part Number 1: 478-1521-1-ND; Technology: Ceramic; ComponentLink1URL: http://datasheets.avx.com/X7RDielectric.pdf
D7 = CMP-0002951-3: LED, Red, SMD; Manufacturer: Wurth Elektronik; Type: AlInGaP; Vf_V: 1.9V; Io_A: 30mA; Vr_V: 5V; Ir_A: 25µA; Tjmax_C: 85°C; Power_TotalModule: 72mW; Value1: 0.072W; Angle: 140; PartNumber: 150080SS75000; PackageReference: LED_0805; RoHS: Y; CompType: LED; MountType: SMT; Value2: 1.9V; Color: Red; ComponentLink1URL: http://katalog.we-online.de/led/datasheet/150080SS75000.pdf; ComponentLink1Description: Datasheet link
D8 = CMP-0002960-2: LED, Bright Green, SMD; Manufacturer: Wurth Elektronik; Type: AlInGaP; Vf_V: 2V; Io_A: 20mA; Vr_V: 5V; Tjmax_C: 85°C; Power_TotalModule: 72mW; Value1: 0.072W; Angle: 140; U/M: EA; PartNumber: 150080VS75000; PackageReference: LED_0805; RoHS: Y; CompType: LED; MountType: SMT; Value2: 2V; Color: Bright Green; Published: 2008-07-11; Publisher: Texas Instruments; ComponentLink1URL: http://katalog.we-online.de/led/datasheet/150080VS75000.pdf; ComponentLink1Description: Datasheet link; LatestRevisionDate: 2017-03-09; Supplier 1: Digi-Key; Supplier Part Number 1: 732-4986-1-ND; Supplier 2: Newark; Supplier Part Number 2: 95W3803; Supplier 3: Mouser; Supplier Part Number 3: 710-150080VS75000
J5#2 J6#2 = CMP-0086350-1: Connector, RJ45, 1x1, Gold, R/A, SMT; Manufacturer: Wurth Elektronik; Row_Count: 1; Gender: Female; ComponentLink1URL: https://sps16.itg.ti.com/sites/KMS/crossdivteams/altium/docs/ComponentDatasheets/7498010210A.pdf; ContactFinish: Gold; MountType: SMT; PinCount: 12; RoHS: Y; PackageReference: Connector, RJ45, 1x1, Gold, R/A, SMT; ComponentLink1Description: Datasheet URL; Orientation: R/A; CompType: RJ45; PartNumber: 7498010210A
R114 R115 R121#2 R122#2 R135 R136 R145#2 R146#2 = CMP-0026738-1: RES, 49.9, 1%, 0.063 W, 0402; Manufacturer: Yageo America; Power_W: 63mW; TempCo: 100 ppm/C; Value_Code: 49R9; U/M: EA; Value: 49.9; EIA_Code: E96; SizeX_mm: 1; SizeY_mm: 0.5; SizeZ_mm: 0.6; Value2: 0.063W; AEC Qualified: N; VDC_V: 50V; AEC Category: Q200; ComponentLink1URL: http://www.yageo.com/documents/recent/PYu-RC_Group_51_RoHS_L_1.pdf; Supplier Part Number 2: 67R9942; Publisher: Texas Instruments; Supplier 2: Newark; Supplier Part Number 3: 603-RC0402FR-0749R9L; Supplier 3: Mouser; Published: 2008-06-26; RoHS: Y; Value1: 1%; MountType: SMT; Supplier 1: Digi-Key; PackageReference: 0402; Tolerance_%: 1%; Res_ohm: 49.9; SizeArea_mm2: 0.5; CompType: Resistor; LatestRevisionDate: 2017-03-09; PartNumber: RC0402FR-0749R9L; ComponentLink1Description: Datasheet link; AEC Grade: N/A; Supplier Part Number 1: 311-49.9LRCT-ND; Technology: Thick Film
R116 R117 = CMP-0026938-5: RES, 4.7 k, 5%, 0.063 W, AEC-Q200 Grade 0, 0402; Manufacturer: Vishay-Dale; Power_W: 63mW; TempCo: 200 ppm/C; Value_Code: 4k70; Value: 4.7k; EIA_Code: E24; SizeX_mm: 1; SizeY_mm: 0.5; SizeZ_mm: 0.6; Value2: 0.063W; AEC Qualified: Y; VDC_V: 50V; AEC Category: Q200; AEC Grade: 0; Supplier Part Number 2: 59M6733; Supplier 2: Newark; Supplier Part Number 3: 71-CRCW0402J-4.7K-E3; Supplier 3: Mouser; RoHS: E; Value1: 5%; MountType: SMT; Supplier 1: Digi-Key; PackageReference: 0402; Tolerance_%: 5%; Res_ohm: 4.7k; SizeArea_mm2: 0.5; CompType: Resistor; PartNumber: CRCW04024K70JNED; ComponentLink1Description: Datasheet link; Supplier Part Number 1: 541-4.7KJCT-ND; Technology: Thick Film; ComponentLink1URL: http://www.vishay.com/docs/20035/dcrcwe3.pdf
R118#2 R119#2 R127#2 R128-R132 R141 R142 R143#2 R151-R155 = CMP-0027010-2: RES, 2.2 k, 5%, 0.05 W, 0201; Manufacturer: Vishay-Dale; Power_W: 50mW; TempCo: 200 ppm/C; Value_Code: 2k20; Value: 2.2k; EIA_Code: E24; SizeX_mm: 0.6; SizeY_mm: 0.3; SizeZ_mm: 0.26; Value2: 0.05W; SizeArea_mm2: 0.18; AEC Qualified: N; VDC_V: 30V; AEC Category: Q200; ComponentLink1URL: http://www.vishay.com/docs/20052/crcw0201e3.pdf; Supplier Part Number 2: 48P7324; Supplier 2: Newark; Supplier Part Number 3: 71-CRCW02012K20JNED; Supplier 3: Mouser; RoHS: E; Value1: 5%; MountType: SMT; Supplier 1: Digi-Key; PackageReference: 0201; Tolerance_%: 5%; Res_ohm: 2.2k; CompType: Resistor; PartNumber: CRCW02012K20JNED; ComponentLink1Description: Datasheet link; AEC Grade: N/A; Supplier Part Number 1: 541-2.2KAGCT-ND; Technology: Thick Film
R120#2 R144#2 = CMP-0026413-2: RES, 4.87 k, 1%, 0.063 W, AEC-Q200 Grade 0, 0402; Manufacturer: Vishay-Dale; Power_W: 63mW; TempCo: 100 ppm/C; Value_Code: 4k87; Value: 4.87k; EIA_Code: E96; SizeX_mm: 1; SizeY_mm: 0.5; SizeZ_mm: 0.6; Value2: 0.063W; AEC Qualified: Y; VDC_V: 50V; AEC Category: Q200; AEC Grade: 0; ComponentLink1URL: http://www.vishay.com/docs/20035/dcrcwe3.pdf; Supplier Part Number 2: 52K7047; Supplier 2: Newark; Supplier Part Number 3: 71-CRCW0402-4.87K-E3; Supplier 3: Mouser; RoHS: E; Value1: 1%; MountType: SMT; Supplier 1: Digi-Key; PackageReference: 0402; Tolerance_%: 1%; Res_ohm: 4.87k; SizeArea_mm2: 0.5; CompType: Resistor; PartNumber: CRCW04024K87FKED; ComponentLink1Description: Datasheet link; Supplier Part Number 1: 541-4.87KLCT-ND; Technology: Thick Film
R123#2 R133 R148#2 R156 = CMP-0026890-5: RES, 2.2 k, 5%, 0.063 W, AEC-Q200 Grade 0, 0402; Manufacturer: Vishay-Dale; Power_W: 63mW; TempCo: 200 ppm/C; Value_Code: 2k20; Value: 2.2k; EIA_Code: E24; SizeX_mm: 1; SizeY_mm: 0.5; SizeZ_mm: 0.6; Value2: 0.063W; AEC Qualified: Y; VDC_V: 50V; AEC Category: Q200; AEC Grade: 0; Supplier Part Number 2: 59M6710; Supplier 2: Newark; Supplier Part Number 3: 71-CRCW0402J-2.2K-E3; Supplier 3: Mouser; RoHS: E; Value1: 5%; MountType: SMT; Supplier 1: Digi-Key; PackageReference: 0402; Tolerance_%: 5%; Res_ohm: 2.2k; SizeArea_mm2: 0.5; CompType: Resistor; PartNumber: CRCW04022K20JNED; ComponentLink1Description: Datasheet link; Supplier Part Number 1: 541-2.2KJCT-ND; Technology: Thick Film; ComponentLink1URL: http://www.vishay.com/docs/20035/dcrcwe3.pdf
R124#2 R147#2 = CMP-0078669-1: RES, 10.0 k, 1%, 0.063 W, 0402; Manufacturer: Yageo America; Power_W: 63mW; Green_Lifecycle: Active; TempCo: 100 ppm/C; Value_Code: 10k0; Green_REACh: Passed; Value: 10.0k; EIA_Code: E96; Res_ohm: 10k; SizeX_mm: 1; SizeY_mm: 0.5; SizeZ_mm: 0.6; Value2: 0.063W; AEC Qualified: N; AEC Category: Q200; ComponentLink1URL: http://www.yageo.com/documents/recent/PYu-RC_Group_51_RoHS_L_8.pdf; Supplier Part Number 2: 98K7499; Supplier 2: Newark; Supplier Part Number 3: 603-RC0402FR-0710KL; Supplier 3: Mouser; RoHS: Y; Value1: 1%; MountType: SMT; Green_EU RoHS-2: Passed; Supplier 1: Digi-Key; Green_EU RoHS: Passed with Exemption; PackageReference: 0402; Tolerance_%: 1%; SizeArea_mm2: 0.5; CompType: Resistor; PartNumber: RC0402FR-0710KL; ComponentLink1Description: Datasheet link; AEC Grade: N/A; Supplier Part Number 1: 311-10.0KLRCT-ND; Technology: Thick Film
R125#2 R134 R149 R157 = CMP-0025813-4: RES, 470, 5%, 0.1 W, AEC-Q200 Grade 0, 0603; Manufacturer: Vishay-Dale; Power_W: 100mW; TempCo: 200 ppm/C; Value_Code: 470R; Value: 470; EIA_Code: E24; SizeX_mm: 1.6; SizeY_mm: 0.8; SizeZ_mm: 1; Value2: 0.1W; SizeArea_mm2: 1.28; AEC Qualified: Y; VDC_V: 75V; AEC Category: Q200; AEC Grade: 0; Supplier Part Number 2: 59M6817; Supplier 2: Newark; Supplier Part Number 3: 71-CRCW0603J-470-E3; Supplier 3: Mouser; RoHS: E; Value1: 5%; MountType: SMT; Supplier 1: Digi-Key; PackageReference: 0603; Tolerance_%: 5%; Res_ohm: 470; CompType: Resistor; PartNumber: CRCW0603470RJNEA; ComponentLink1Description: Datasheet link; Supplier Part Number 1: 541-470GCT-ND; Technology: Thick Film; ComponentLink1URL: http://www.vishay.com/docs/20035/dcrcwe3.pdf
R126#2 R150 = CMP-0026237-2: RES, 2.49 k, 1%, 0.063 W, AEC-Q200 Grade 0, 0402; Manufacturer: Vishay-Dale; Power_W: 63mW; TempCo: 100 ppm/C; Value_Code: 2k49; Value: 2.49k; EIA_Code: E96; SizeX_mm: 1; SizeY_mm: 0.5; SizeZ_mm: 0.6; Value2: 0.063W; AEC Qualified: Y; VDC_V: 50V; AEC Category: Q200; AEC Grade: 0; ComponentLink1URL: http://www.vishay.com/docs/20035/dcrcwe3.pdf; Supplier Part Number 2: 52K6803; Supplier 2: Newark; Supplier Part Number 3: 71-CRCW0402-2.49K-E3; Supplier 3: Mouser; RoHS: E; Value1: 1%; MountType: SMT; Supplier 1: Digi-Key; PackageReference: 0402; Tolerance_%: 1%; Res_ohm: 2.49k; SizeArea_mm2: 0.5; CompType: Resistor; PartNumber: CRCW04022K49FKED; ComponentLink1Description: Datasheet link; Supplier Part Number 1: 541-2.49KLCT-ND; Technology: Thick Film
R137 = CMP-0026081-3: RES, 1.27 k, 1%, 0.063 W, AEC-Q200 Grade 0, 0402; Manufacturer: Vishay-Dale; Power_W: 63mW; TempCo: 100 ppm/C; Value_Code: 1k27; Value: 1.27k; EIA_Code: E96; SizeX_mm: 1; SizeY_mm: 0.5; SizeZ_mm: 0.6; Value2: 0.063W; AEC Qualified: Y; VDC_V: 50V; AEC Category: Q200; AEC Grade: 0; Supplier Part Number 2: 52K6562; Supplier 2: Newark; Supplier Part Number 3: 71-CRCW0402-1.27K-E3; Supplier 3: Mouser; RoHS: E; Value1: 1%; MountType: SMT; Supplier 1: Digi-Key; PackageReference: 0402; Tolerance_%: 1%; Res_ohm: 1.27k; SizeArea_mm2: 0.5; CompType: Resistor; PartNumber: CRCW04021K27FKED; ComponentLink1Description: Datasheet link; Supplier Part Number 1: 541-1.27KLCT-ND; Technology: Thick Film; ComponentLink1URL: http://www.vishay.com/docs/20035/dcrcwe3.pdf
R138#2 = CMP-0026962-3: RES, 680, 5%, 0.063 W, AEC-Q200 Grade 0, 0402; Manufacturer: Vishay-Dale; Value: 680; Value_Code: 680R; Power_W: 63mW; Value2: 0.063W; VDC_V: 50V; TempCo: 200 ppm/C; EIA_Code: E24; AEC Category: Q200; AEC Qualified: Y; AEC Grade: 0; SizeArea_mm2: 0.5; SizeX_mm: 1; SizeZ_mm: 0.6; CompType: Resistor; PartNumber: CRCW0402680RJNED; PackageReference: 0402; RoHS: E; Res_ohm: 680; Tolerance_%: 5%; Value1: 5%; MountType: SMT; Technology: Thick Film; ComponentLink1Description: Datasheet link; ComponentLink1URL: http://www.vishay.com/docs/20035/dcrcwe3.pdf; Supplier 1: Digi-Key; Supplier Part Number 1: 541-680JCT-ND; Supplier 2: Newark; Supplier Part Number 2: 59M6744; Supplier 3: Mouser; Supplier Part Number 3: 71-CRCW0402J-680-E3; SizeY_mm: 0.5
R139#2 R140 = CMP-0026863-2: RES, 1.5 M, 5%, 0.063 W, AEC-Q200 Grade 0, 0402; Manufacturer: Vishay-Dale; Power_W: 63mW; TempCo: 200 ppm/C; Value_Code: 1M50; Value: 1.5Meg; EIA_Code: E24; SizeX_mm: 1; SizeY_mm: 0.5; SizeZ_mm: 0.6; Value2: 0.063W; AEC Qualified: Y; VDC_V: 50V; AEC Category: Q200; AEC Grade: 0; ComponentLink1URL: http://www.vishay.com/docs/20035/dcrcwe3.pdf; Supplier Part Number 2: 71-CRCW04021M50JNED; Supplier 2: Mouser; RoHS: E; Value1: 5%; MountType: SMT; Supplier 1: Digi-Key; PackageReference: 0402; Tolerance_%: 5%; Res_ohm: 1.5M; SizeArea_mm2: 0.5; CompType: Resistor; PartNumber: CRCW04021M50JNED; ComponentLink1Description: Datasheet link; Supplier Part Number 1: 541-1.5MJCT-ND; Technology: Thick Film
U18 = CMP-0082059-1: 16 Kb I2C EEPROM Serial, SOIC-8; Manufacturer: ON Semiconductor; SizeArea_mm2: 29.351; SizeAreaWB_mm2: 55.131; SizeY_mm: 4.9; SizeZ_mm: 1.75; SizeX_mm: 5.99; PartNumber: CAT24C16WI-GT3; Supplier Part Number 2: 23AC2979; Supplier 3: Mouser; PackageReference: SOIC-8; Supplier Part Number 1: CAT24C16WI-GT3CT-ND; ComponentLink1Description: Datasheet URL; MountType: SMT; ComponentLink1URL: https://www.onsemi.com/pub/Collateral/CAT24C01-D.PDF; Supplier 1: Digi-Key; RoHS: Y; Supplier 2: Newark; Supplier Part Number 3: 698-CAT24C16WI-GT3
U19 U21 = CMP-0076010-3: Robust, Low Power 10/100 Ethernet Physical Layer Transceiver, RHB0032B (VQFN-32); Alternate PartNumber: DP83822IRHBT; Manufacturer: Texas Instruments; SizeZ_mm: 1.0; SizeX_mm: 5.0; SizeArea_mm2: 25.0; CompType: IC; SizeAreaWB_mm2: 49.0; AEC Category: Q200; AEC Qualified: N; ComponentLink1URL: http://www.ti.com/lit/ds/symlink/dp83822i.pdf; PackageDescription: VQFN-32; SizeY_mm: 5.0; PackageReference: RHB0032B; RoHS: Y; PartNumber: DP83822IRHBR; ComponentLink1Description: Datasheet Link; MountType: SMT; Alternate Manufacturer: Texas Instruments; ComponentLink2Description: ComponentLink2Description; ComponentLink2URL: http://www.ti.com/product/dp83822i
U20 = CMP-0051777-1: Dual Inverter Buffer/Driver with Open-Drain Output, DBV0006A, LARGE T&R; Manufacturer: Texas Instruments; Schmitt Trigger: No; Logic: Inverting; F @ Nom Voltage(Max)(Mhz): 150; VCC(Max)(V): 5.5; Rating: Catalog; Sub-Family: Inverting Buffer/Driver; Technology Family: LVC; VCC(Min)(V): 1.65; Voltage(Nom)(V): 1.8,2.5,3.3,5; Output Drive (IOL/IOH)(Max)(mA): 32/-32; Output Type: CMOS; ICC @ Nom Voltage(Max)(mA): 0.01; Bits(#): 2; tpd @ Nom Voltage(Max)(ns): 8.2,4.4,3.9,3.4; Input Type: CMOS/TTL; DatasheetVersion: SCES307I; Generic Part Number: SN74LVC2G06; 3-State Output: No; PackageReference: DBV0006A; Operating Temperature Range(C): -40 to 125,-40 to 85; PartId: 1; PartNumber: SN74LVC2G06DBVR